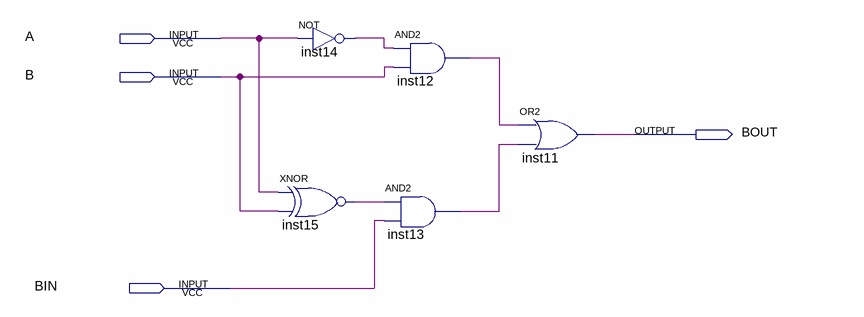
[diagram p0: schematic sheet]
// Quartus schematic rippleBorrower1Bit.bdf as structural Verilog: 5 symbols, 4 pins
module rippleBorrower1Bit (
  input  A,
  input  B,
  input  BIN,
  output BOUT
);

  wire inst12_out, inst13_out, inst14_out, inst15_out;

  not inst14 (inst14_out, A);
  xnor inst15 (inst15_out, A, B);
  and inst12 (inst12_out, inst14_out, B);
  and inst13 (inst13_out, inst15_out, BIN);
  or inst11 (BOUT, inst12_out, inst13_out);
endmodule
